# Altium schematic sheet Arduino_Leonardo-REV3b.SchDoc
size 494 x 320 mm
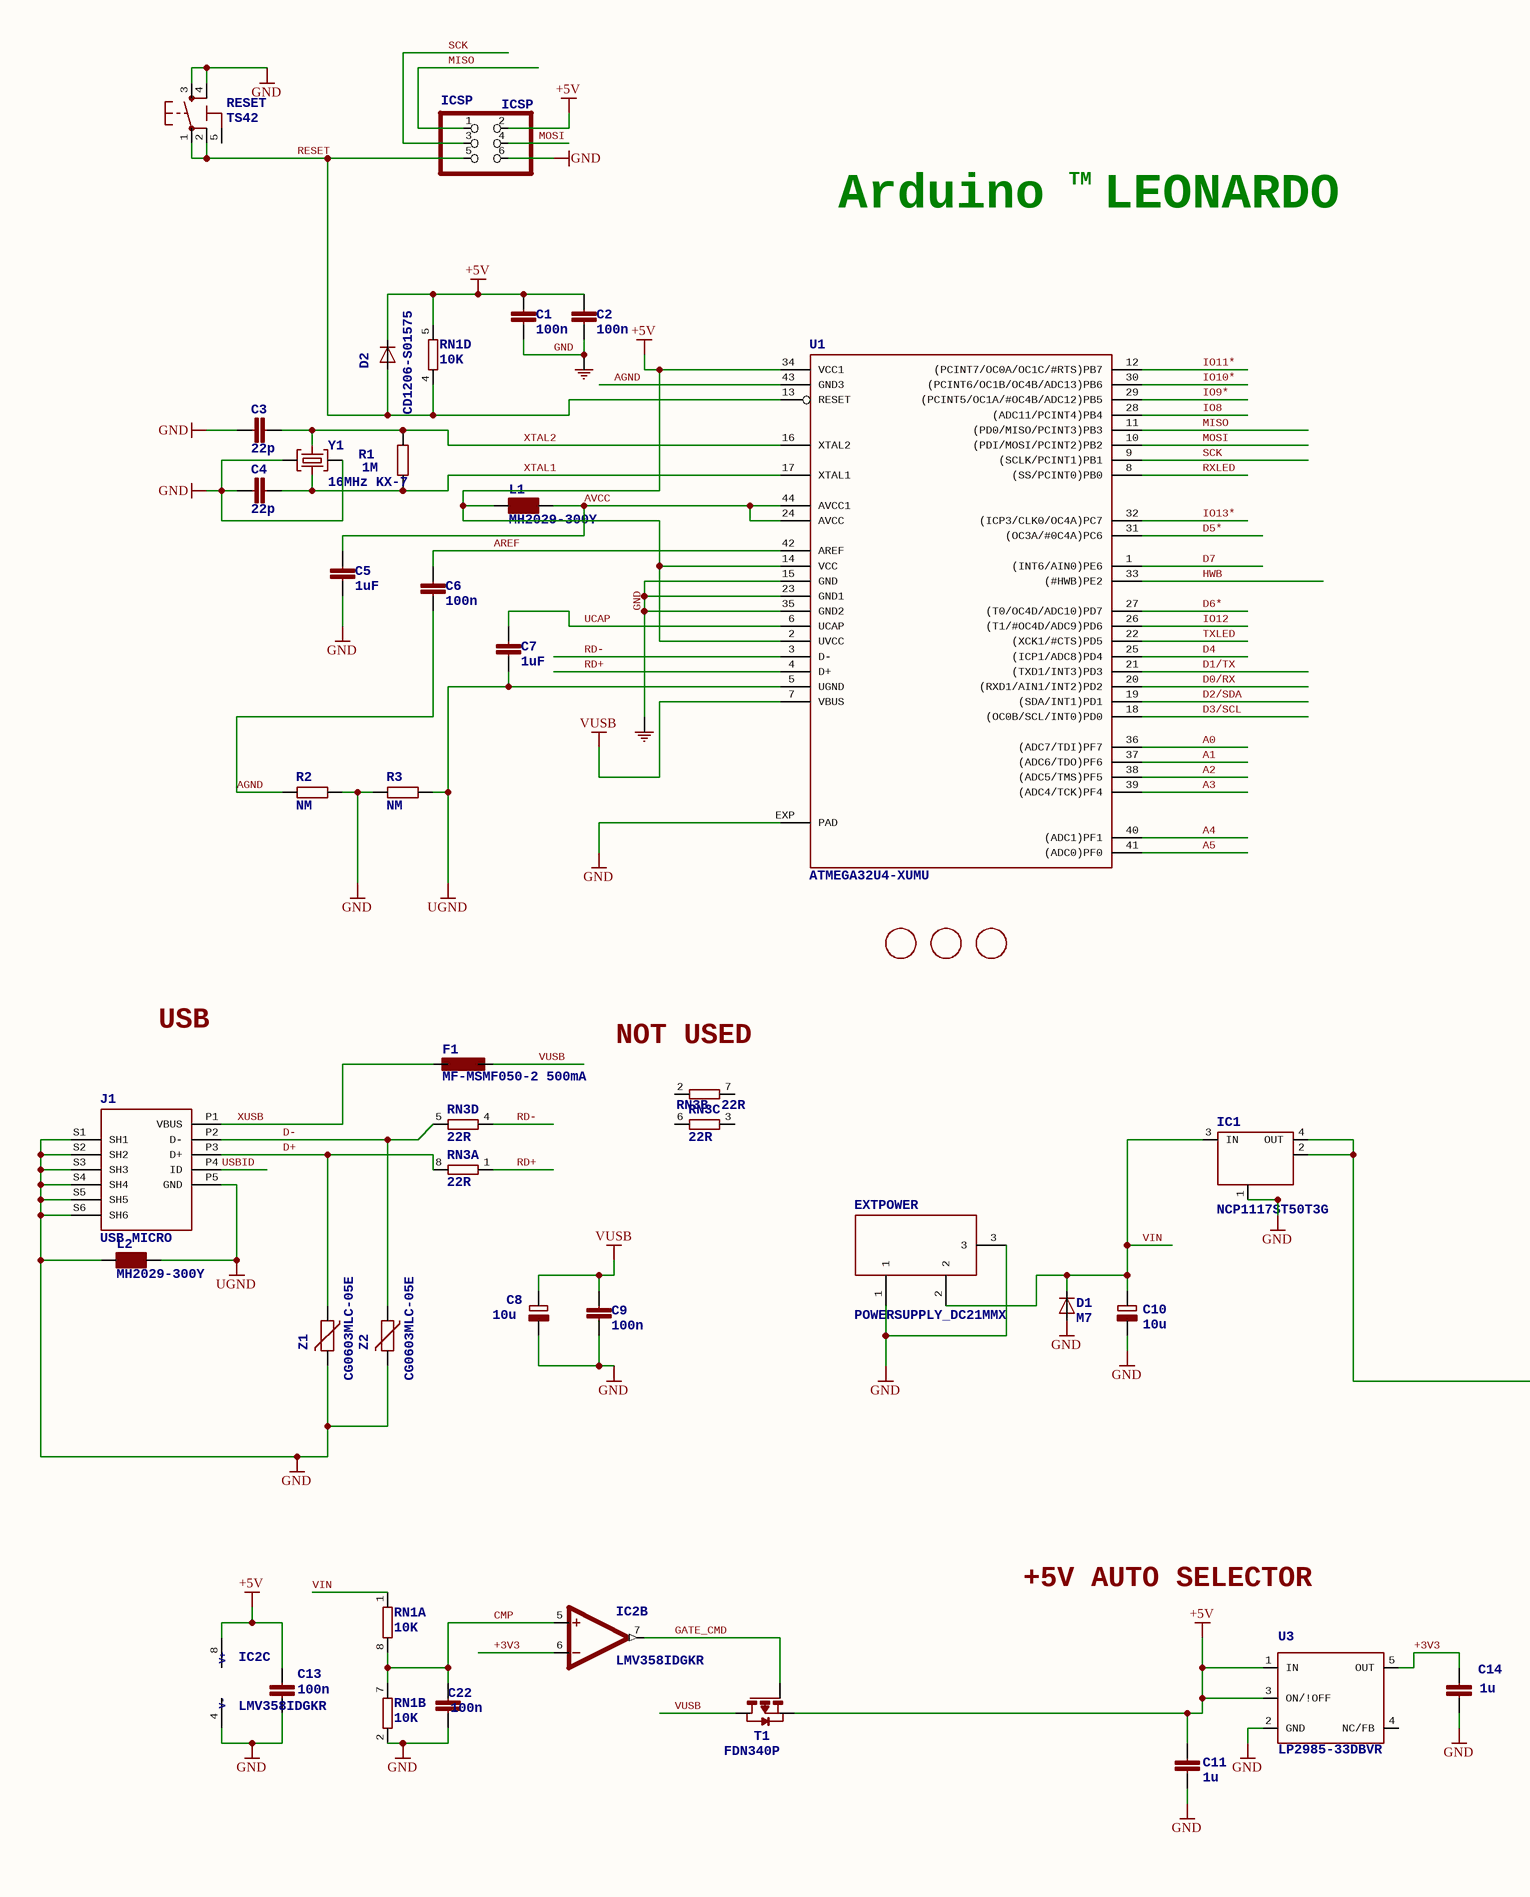
[diagram p0: Arduino_Leonardo-REV3b.SchDoc, left]
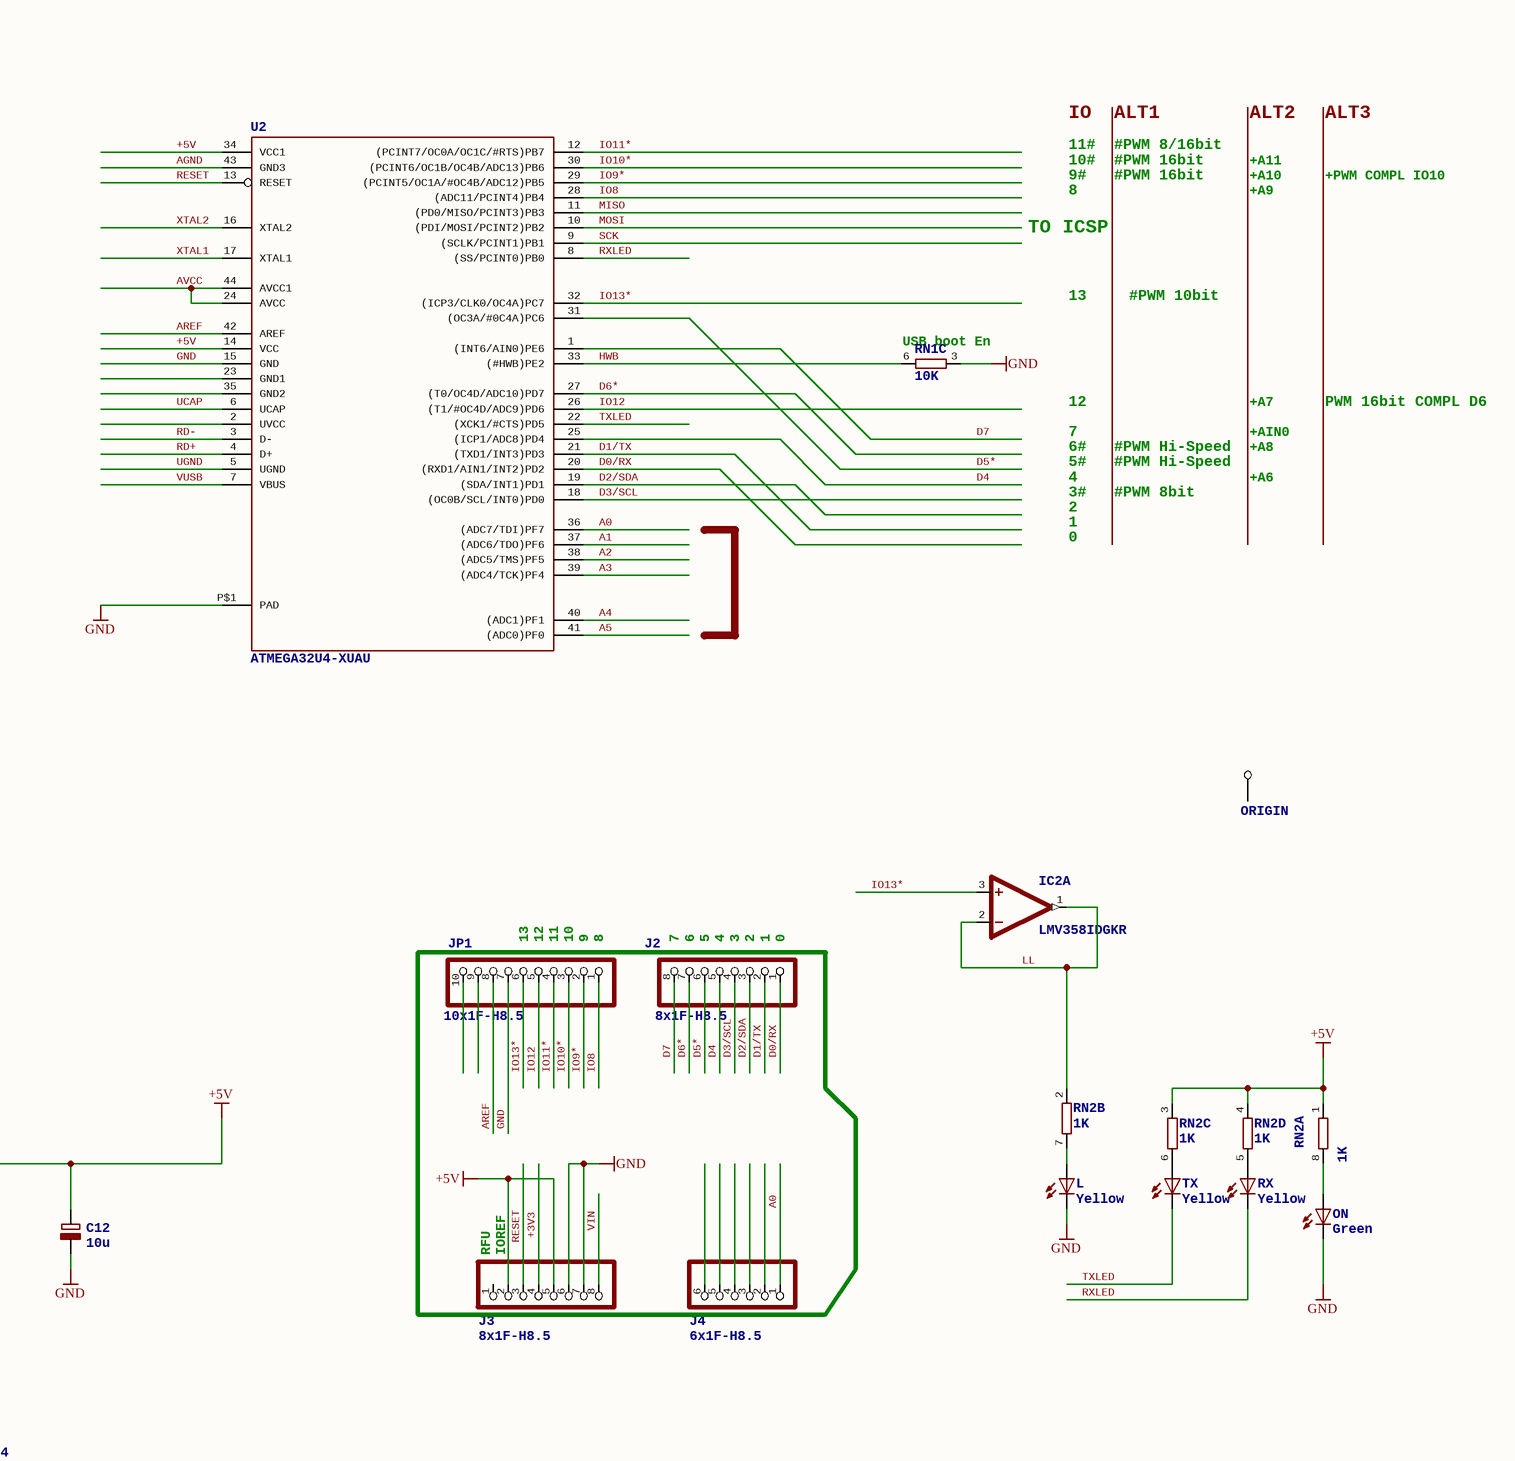
[diagram p1: Arduino_Leonardo-REV3b.SchDoc, right]

## Parts
C1  100n  [C0603-ROUND]
C2  100n  [C0603-ROUND]
C3  22p  [C0603-ROUND]
C4  22p  [C0603-ROUND]
C5  1uF  [C0603-ROUND]
C6  100n  [C0603-ROUND]
C7  1uF  [C0603-ROUND]
C8  10u  [SMC_B]
C9  100n  [C0603-ROUND]
C10  10u  [SMC_B]
C11  1u  [C0603-ROUND]
C12  10u  [SMC_B]
C13  100n  [C0603-ROUND]
C14  1u  [C0603-ROUND]
C22  100n  [C0603-ROUND]
D1  M7  [SMB]
D2  CD1206-S01575  [MINIMELF]
EXTPOWER  POWERSUPPLY_DC21MMX  [POWERSUPPLY_DC-21MM]
F1  MF-MSMF050-2 500mA  [L1812]
FID1  FIDUCIALMOUNT  [FIDUCIA-MOUNT]  (value not drawn)
FID2  FIDUCIALMOUNT  [FIDUCIA-MOUNT]  (value not drawn)
FID3  FIDUCIALMOUNT  [FIDUCIA-MOUNT]  (value not drawn)
IC1  NCP1117ST50T3G  [SOT223]
IC2  LMV358IDGKR  [MSOP08]  (parts A,B,C of 3)
ICSP  ICSP  [2X03]
J1  USB MICRO  [CON2_USB_MICRO_B_AT]
J2  8x1F-H8.5  [1X08]
J3  8x1F-H8.5  [1X08]
J4  6x1F-H8.5  [1X06]
JP1  10x1F-H8.5  [1X10]
L  Yellow  [CHIPLED_0805]
L1  MH2029-300Y  [0805]
L2  MH2029-300Y  [0805]
ON  Green  [CHIPLED_0805]
ORIGIN  TP_SP  [TP-SP]  (value not drawn)
R1  1M  [R0603-ROUND]
R2  NM  [R0402]
R3  NM  [R0402]
RESET  TS42  [TS42]
RN1  10K  [CAY16]  (parts A,B,C,D of 4)
RN2  1K  [CAY16]  (parts A,B,C,D of 4)
RN3  22R  [CAY16]  (parts A,B,C,D of 4)
RX  Yellow  [CHIPLED_0805]
T1  FDN340P  [SOT-23]
TX  Yellow  [CHIPLED_0805]
U1  ATMEGA32U4-XUMU  [QFN44ML7X7]
U2  ATMEGA32U4-XUAU  [TQFP44-PAD]
U3  LP2985-33DBVR  [SOT23-DBV]
U$30  COM  (value not drawn)
U$40  COM  (value not drawn)
Y1  16MHz KX-7  [CRYSTAL-3.2-2.5]
Z1  CG0603MLC-05E  [CT/CN0603]
Z2  CG0603MLC-05E  [CT/CN0603]

## Nets
+5V: C1.1 C2.1 C11.2 C12.+ C13.1 D2.C IC1.2(OUT) IC1.4(OUT) IC2.8(V+) ICSP.2 J3.2 J3.5 L1.1 RN1.5 RN2.1 RN2.3 RN2.4 T1.2(S) U1.2(UVCC) U1.14(VCC) U1.34(VCC1) U2.14(VCC) U2.34(VCC1) U3.1(IN) U3.3(ON/!OFF)
GND: C1.2 C2.2 C3.1 C4.2 C5.2 C8.- C9.1 C10.- C11.1 C12.- C13.2 C14.1 C22.1 D1.A EXTPOWER.1 EXTPOWER.3 IC1.1(GND/ADJ) IC2.4(V-) ICSP.6 J1.S1(SH1) J1.S2(SH2) J1.S3(SH3) J1.S4(SH4) J1.S5(SH5) J1.S6(SH6) J3.6 J3.7 JP1.7 L.C L2.2 ON.C R2.2 R3.1 RESET.3 RESET.4 RN1.2 RN1.3 U1.15(GND) U1.23(GND1) U1.35(GND2) U1.EXP(PAD) U2.15(GND) U2.P$1(PAD) U3.2(GND) U$30.?1(COM) U$40.?1(COM) Y1.2(GND) Y1.4(GND) Z1.2 Z2.2
UGND: C7.2 J1.P5(GND) L2.1 R3.2 U1.5(UGND) U2.5(UGND)
VUSB: C8.+ C9.2 F1.1 T1.1(D) U1.7(VBUS) U2.7(VBUS)
+3V3: C14.2 IC2.6(-IN) J3.4 U3.5(OUT)
A0: J4.1 U1.36((ADC7/TDI)PF7) U2.36((ADC7/TDI)PF7)
A1: U1.37((ADC6/TDO)PF6) U2.37((ADC6/TDO)PF6)
A2: U1.38((ADC5/TMS)PF5) U2.38((ADC5/TMS)PF5)
A3: U1.39((ADC4/TCK)PF4) U2.39((ADC4/TCK)PF4)
A4: U1.40((ADC1)PF1) U2.40((ADC1)PF1)
A5: U1.41((ADC0)PF0) U2.41((ADC0)PF0)
AGND: C6.1 R2.1 U1.43(GND3) U2.43(GND3)
AREF: C6.2 JP1.8 U1.42(AREF) U2.42(AREF)
AVCC: C5.1 L1.2 U1.24(AVCC) U1.44(AVCC1) U2.24(AVCC) U2.44(AVCC1)
CMP: C22.2 IC2.5(+IN) RN1.7 RN1.8
D0/RX: J2.1 U1.20((RXD1/AIN1/INT2)PD2) U2.20((RXD1/AIN1/INT2)PD2)
D1/TX: J2.2 U1.21((TXD1/INT3)PD3) U2.21((TXD1/INT3)PD3)
D2/SDA: J2.3 U1.19((SDA/INT1)PD1) U2.19((SDA/INT1)PD1)
D3/SCL: J2.4 U1.18((OC0B/SCL/INT0)PD0) U2.18((OC0B/SCL/INT0)PD0)
D4: J2.5 U1.25((ICP1/ADC8)PD4) U2.25((ICP1/ADC8)PD4)
D5*: J2.6 U1.31((OC3A/#0C4A)PC6) U2.31((OC3A/#0C4A)PC6)
D6*: J2.7 U1.27((T0/OC4D/ADC10)PD7) U2.27((T0/OC4D/ADC10)PD7)
D7: J2.8 U1.1((INT6/AIN0)PE6) U2.1((INT6/AIN0)PE6)
D+: J1.P3(D+) RN3.8 Z1.1
D-: J1.P2(D-) RN3.5 Z2.1
GATE_CMD: IC2.7(OUT) T1.3(G)
HWB: RN1.6 U1.33((#HWB)PE2) U2.33((#HWB)PE2)
IO8: JP1.1 U1.28((ADC11/PCINT4)PB4) U2.28((ADC11/PCINT4)PB4)
IO9*: JP1.2 U1.29((PCINT5/OC1A/#OC4B/ADC12)PB5) U2.29((PCINT5/OC1A/#OC4B/ADC12)PB5)
IO10*: JP1.3 U1.30((PCINT6/OC1B/OC4B/ADC13)PB6) U2.30((PCINT6/OC1B/OC4B/ADC13)PB6)
IO11*: JP1.4 U1.12((PCINT7/OC0A/OC1C/#RTS)PB7) U2.12((PCINT7/OC0A/OC1C/#RTS)PB7)
IO12: JP1.5 U1.26((T1/#OC4D/ADC9)PD6) U2.26((T1/#OC4D/ADC9)PD6)
IO13*: IC2.3(+IN) JP1.6 U1.32((ICP3/CLK0/OC4A)PC7) U2.32((ICP3/CLK0/OC4A)PC7)
LL: IC2.1(OUT) IC2.2(-IN) RN2.2
MISO: ICSP.1 U1.11((PD0/MISO/PCINT3)PB3) U2.11((PD0/MISO/PCINT3)PB3)
MOSI: ICSP.4 U1.10((PDI/MOSI/PCINT2)PB2) U2.10((PDI/MOSI/PCINT2)PB2)
RD+: RN3.1 U1.4(D+) U2.4(D+)
RD-: RN3.4 U1.3(D-) U2.3(D-)
RESET: D2.A ICSP.5 J3.3 RESET.1 RESET.2 RN1.4 U1.13(RESET) U2.13(RESET)
RXLED: RX.C U1.8((SS/PCINT0)PB0) U2.8((SS/PCINT0)PB0)
SCK: ICSP.3 U1.9((SCLK/PCINT1)PB1) U2.9((SCLK/PCINT1)PB1)
TXLED: TX.C U1.22((XCK1/#CTS)PD5) U2.22((XCK1/#CTS)PD5)
UCAP: C7.1 U1.6(UCAP) U2.6(UCAP)
USBID: J1.P4(ID)
VIN: C10.+ D1.C EXTPOWER.2 IC1.3(IN) J3.8 RN1.1
XTAL1: C4.1 R1.1 U1.17(XTAL1) U2.17(XTAL1) Y1.1(C1)
XTAL2: C3.2 R1.2 U1.16(XTAL2) U2.16(XTAL2) Y1.3(C2)
XUSB: F1.2 J1.P1(VBUS)
NetL_A: L.A RN2.7
NetON_A: ON.A RN2.8
NetRN2_5: RN2.5 RX.A
NetRN2_6: RN2.6 TX.A

Not connected (* = marked no-connect by the designer): J3 1; J4 2 3 4 5 6; JP1 9 10; ORIGIN X(TESTP); RESET 5(5-GND); RN3 2(1) 3(1) 6(2) 7(2); U2 2(UVCC) 23(GND1) 35(GND2); U3 4(NC/FB)

## Notes on the sheet
- Arduino  LEONARDO
- TM
- 10#
- 9#
- 11#
- IO
- #PWM 8/16bit
- #PWM 16bit
- ALT1
- +A11
- +A10
- ALT2
- +PWM COMPL IO10
- ALT3
- TO ICSP
- 8
- +A9
- 13
- #PWM 10bit
- (near RN1) USB boot En
- 12
- +A7
- PWM 16bit COMPL D6
- 4
- 5#
- 6#
- 7
- #PWM Hi-Speed
- +A6
- +A8
- +AIN0
- 0
- 1
- 2
- 3#
- #PWM 8bit
- USB
- (near RN3) NOT USED
- (near JP1) 13
- (near JP1) 12
- (near JP1) 11
- (near JP1) 10
- (near JP1) 9
- (near JP1) 8
- (near J2) 7
- (near J2) 6
- (near J2) 5
- (near J2) 4
- (near J2) 3
- (near J2) 2
- (near J2) 1
- (near J2) 0
- (near J3) RFU
- (near J3) IOREF
- +5V AUTO SELECTOR

## Library data of the parts
C1-C7 C9 C11 C13 C14 C22 = C-EUC0603: CAPACITOR, European symbol
C8 C10 C12 = CPOL-EUSMCB: POLARIZED CAPACITOR, European symbol
D1 = DIODE-SMB: DIODE
D2 = DIODE-MINIMELF: DIODE
F1 = L-EUL1812: INDUCTOR, European symbol
IC1 = MC33269ST*: Adjustable Output Low Dropout Voltage Regulator 800 mA   Source: http://www.onsemi.com/pub/Collateral/MC33269-D.PDF
IC2 = LMV358?*MM: Dual General Purpose, Low Voltage, Rail-to-Rail Output Operational Amplifiers   Source: http://www.national.com/mpf/LM/LMV321.html http://www.national.com/dt/lmv_qual.pdf
ICSP = PINHD-2X3: PIN HEADER
J1 = MYCON2_USB-MINI-B
J2 J3 = PINHD-1X8: PIN HEADER
J4 = PINHD-1X6: PIN HEADER
JP1 = PINHD-1X10: PIN HEADER
L ON RX TX = LEDCHIPLED_0805: LED   OSRAM: - CHIPLED LG R971, LG N971, LY N971, LG Q971, LY Q971, LO R971, LY R971 LH N974, LH R974 LS Q976, LO Q976, LY Q976 LO Q996 - Hyper CHIPLED LW Q18S LB Q993, LB Q99A, LB R99A - SideLED LS A670, LO A670, LY A670, LG A670, LP A670 LB A673, LV A673, LT A673, LW A673 LH A674 LY A675 LS A676, LA A676, LO A676, LY A676, LW A676 LS A679, LY A679, LG A679 -  Hyper Micro SIDELED® LS Y876, LA Y876, LO Y876, LY Y876 LT Y87S - SmartLED LW L88C, LW L88S LB L89C, LB L89S, LG L890 LS L89K, LO L89K, LY L89K LS L896, LA L896, LO L896, LY L896 - TOPLED LS T670, LO T670, LY T670, LG T670, LP T670 LSG T670, LSP T670, LSY T670, LOP T670, LYG T670 LG T671, LOG T671, LSG T671 LB T673, LV T673, LT T673, LW T673 LH T674 LS T676, LA T676, LO T676, LY T676, LB T676, LH T676, LSB T676, LW T676 LB T67C, LV T67C, LT T67C, LS T67K, LO T67K, LY T67K, LW E67C LS E67B, LA E67B, LO E67B, LY E67B, LB E67C, LV E67C, LT E67C LW T67C LS T679, LY T679, LG T679 LS T770, LO T770, LY T770, LG T770, LP T770 LB T773, LV T773, LT T773, LW T773 LH T774 LS E675, LA E675, LY E675, LS T675 LS T776, LA T776, LO T776, LY T776, LB T776 LHGB T686 LT T68C, LB T68C - Hyper Mini TOPLED® LB M676 - Mini TOPLED Santana® LG M470 LS M47K, LO M47K, LY M47K    Source: http://www.osram.convergy.de   LUXEON: - LUMILED® LXK2-PW12-R00, LXK2-PW12-S00, LXK2-PW14-U00, LXK2-PW14-V00 LXK2-PM12-R00, LXK2-PM12-S00, LXK2-PM14-U00 LXK2-PE12-Q00, LXK2-PE12-R00, LXK2-PE12-S00, LXK2-PE14-T00, LXK2-PE14-U00 LXK2-PB12-K00, LXK2-PB12-L00, LXK2-PB12-M00, LXK2-PB14-N00, LXK2-PB14-P00, LXK2-PB14-Q00 LXK2-PR12-L00, LXK2-PR12-M00, LXK2-PR14-Q00, LXK2-PR14-R00 LXK2-PD12-Q00, LXK2-PD12-R00, LXK2-PD12-S00 LXK2-PH12-R00, LXK2-PH12-S00 LXK2-PL12-P00, LXK2-PL12-Q00, LXK2-PL12-R00    Source: www.luxeon.com   KINGBRIGHT:   KA-3528ASYC Source: www.kingbright.com
L1 L2 = WE-CBF_0805: SMD EMI Suppression Ferrite Beads - excellent anti-EMI properties - low DCR - impedances till 3000 ohms - rated current up to 6 A
R1 = R-EU_R0603: RESISTOR, European symbol
R2 R3 = R-EU_R0402: RESISTOR, European symbol
RESET = TS42: TS42 Dongnan Electronics Tact switch VDC 12V - 50mA
RN1-RN3 = 4R-NCAY16: Array Chip Resistor   Source: RS Component / Phycomp
T1 = PMOSSOT23: MOS FET
U3 = LP2985-XXDBVR: ULTRALOW-POWER 50-mA LOW-DROPOUT LINEAR REGULATORS   50-mA Low-Dropout Regulator Source: http://focus.ti.com/lit/ds/symlink/tps77001.pdf
Y1 = CRYSTAL-3.2-2.5
Z1 Z2 = VARISTORCN0603: VARISTOR